# Altium schematic sheet ivt33_kuznecov_list2_9var.SchDoc
size 420 x 297 mm; SheetNumber: 2; SheetTotal: 2
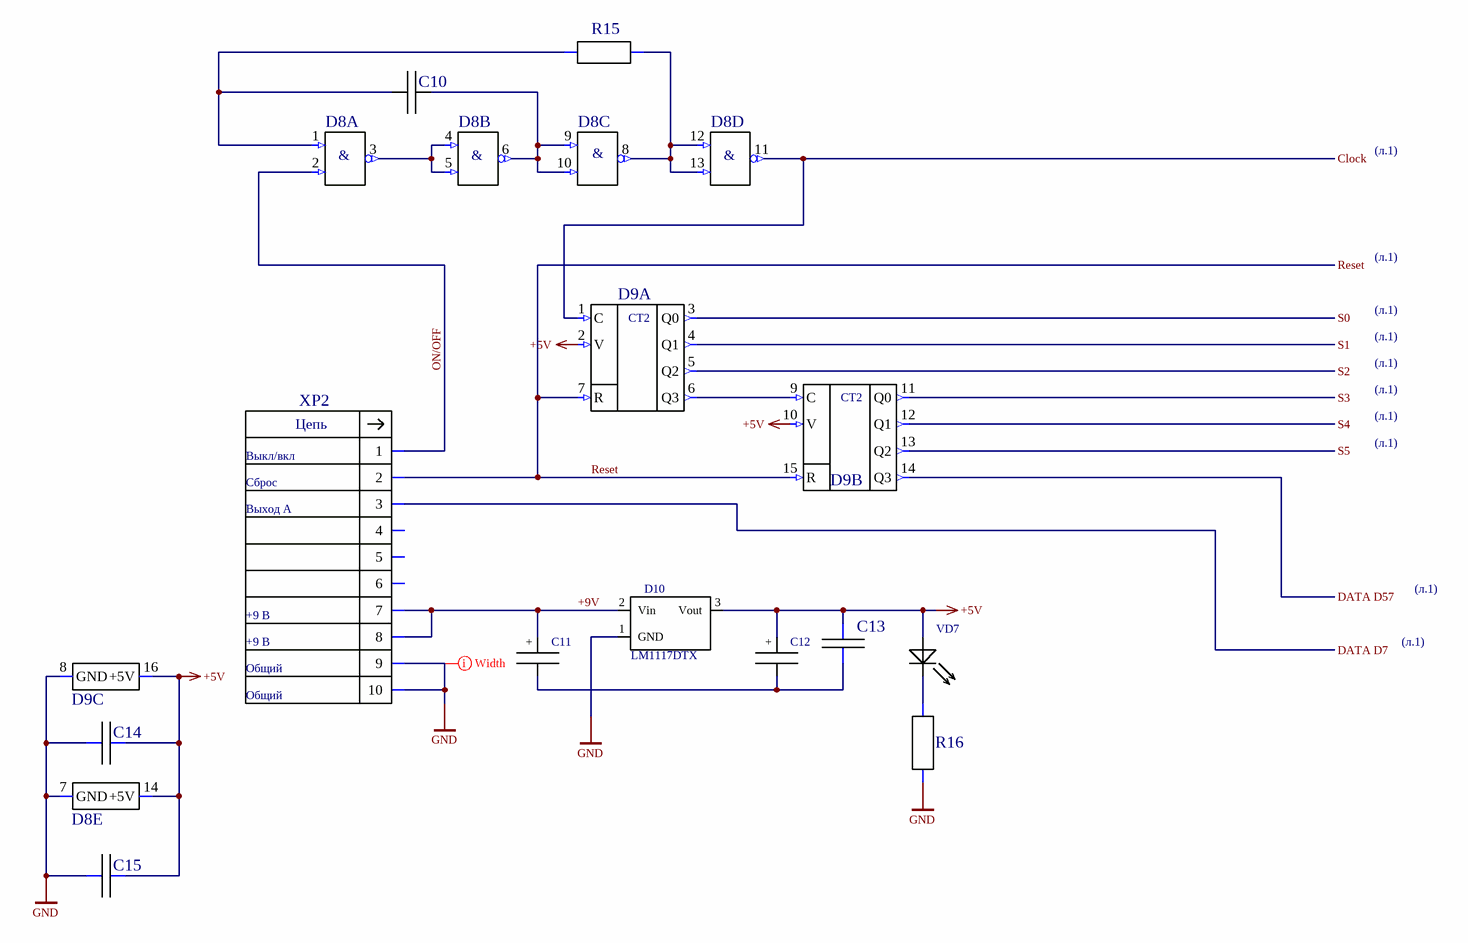
[diagram p0: ivt33_kuznecov_list2_9var.SchDoc]

## Parts
C10  1210  [K10-79_3.2_2.5(1210)]  (value not drawn)
C11  *  [CA010M0010REB-0405]  (value not drawn)
C12  *  [CA010M0010REB-0405]  (value not drawn)
C13  (no value)  [0805_N]
C14  (no value)  [0805_N]
C15  (no value)  [0805_N]
D8  74AC00SC  [SO14-N]  (value not drawn)  (parts A,B,C,D,E of 5)
D9  (no value)  [SOIC-16W-N]  (parts A,B,C of 3)
D10  LM1117DTX  [LM1117DTX-5.0/NOPB]
R15  0805  [RES_0805_2012_N]  (value not drawn)
R16  (no value)  [RES_0603_1608_N]
VD7  *  [LED_5mm]  (value not drawn)
XP2  TE_1-1634689-0  [BH-10R]  (value not drawn)

## Ports
Clock (out), DATA D7 (out), DATA D57 (out), Reset (out), S0 (out), S1 (out), S2 (out), S3 (out), S4 (out), S5 (out)

## Nets
+5V: C12.+ C13.2 C14.2 C15.2 D8.14(+5V) D9.2(V) D9.10(V) D9.16(+5V) D10.3(Vout) VD7.A
GND: C14.1 C15.1 D8.7(GND) D9.8(GND) D10.1(GND) R16.1 XP2.9 XP2.10
+9V: C11.+ D10.2(Vin) XP2.7 XP2.8
Clock: D8.11(Out) D9.1(C) ; port Clock
DATA D7: XP2.3 ; port DATA D7
DATA D57: D9.14(Q3) ; port DATA D57
ON/OFF: D8.2(In2) XP2.1
Reset: D9.7(R) D9.15(R) XP2.2 ; port Reset
S0: D9.3(Q0) ; port S0
S1: D9.4(Q1) ; port S1
S2: D9.5(Q2) ; port S2
S3: D9.11(Q0) ; port S3
S4: D9.12(Q1) ; port S4
S5: D9.13(Q2) ; port S5
NetC10_1: C10.1 D8.1(In1) R15.1
NetC10_2: C10.2 D8.6(Out) D8.9(In1) D8.10(In2)
NetC11_-: C11.- C12.- C13.1
NetD8_3: D8.3(Out) D8.4(In1) D8.5(In2)
NetD8_8: D8.8(Out) D8.12(In1) D8.13(In2) R15.2
NetD9_6: D9.6(Q3) D9.9(C)
NetR16_2: R16.2 VD7.C

Not connected (* = marked no-connect by the designer): XP2 4 5 6

## Layout directives
mark named Width: GND

## Notes on the sheet
- (л.1)
- Выкл/вкл
- Сброс
- Выход A
- +9 В
- Общий
- Подп. дата
- Инв. № дубл.
- Взам. инв. №
- Подп. и дата
- Инв. № подл.
- Изм.
- Лист
- № докум.
- Подп.
- Дата
- ALTIUM GOSTBOM2.0 KEV
- Файл:
- Копировал
- Формат А3
- (in symbol 74AC00SC, part A) &
- (in symbol 74AC00SC, part B) &
- (in symbol 74AC00SC, part C) &
- (in symbol 74AC00SC, part D) &
- (in symbol MC14520BDWG, part A) CT2
- (in symbol MC14520BDWG, part B) CT2
- (in symbol TE_1-1634689-0) Цепь

## Library data of the parts
C10 = К10-79_1210_Н30: Чип конденсатор 1210 Н30 ряд Е6; Manufacturer: ООО "Кулон"; Name: Конденсатор К10-79; Reliability: 0.000005; Permit MPSU: разрешен; LiveStatus: производится; Packing: катушка; LibraryEngeneer: Желобаев; Tolerance: ±20%; Datum: 19_12_2018; TU: АЖЯР.673511.004 ТУ; Type: K10-79; Hight: 1.75; BOM: Конденсатор К10-79-*-B-*±20%-Н30 АЖЯР.673511.004 ТУ; Version: 00; HelpURL: \\papa\Info\Altium_Library\Даташиты_и_ТУ\Конденсаторы_отечественные\К10-79_АЖЯР_673511_004ТУ.pdf; Weight: 0.2; Voltage: *; TKE: Н30; Size: 1210; Value: *; Value_KD: *
C11 C12 = CA010M0010REB-0405: Электролитический SND
C13-C15 = К10-79_0805_Н90: Чип конденсатор 0805 Н90 ряд Е6; Manufacturer: ООО "Кулон"; Name: К10-79; Tolerance: +80%-20%; TU: АЖЯР.673511.004 ТУ; Type: K10-79; BOM: К10-79-*-B-*+80%-20%-Н90 АЖЯР.673511.004 ТУ; Created_by: Желобаев; Name2: Конденсатор К10-79; Version: 0; Weight: 0.05; Voltage: *; TKE: Н90; Value: *; Value_KD: *; Case: 0805; Issue_date: 19_12_2018
D8 = 74AC00SC: 4 элемента 2И-НЕ TTL SOIC-14; Manufacturer: ON Semiconductor; BOM: 74AC00SC "ON Semiconductor"; Created_by: Желобаев; Power_Voltage: 4.5 - 5.5 V; Name2: Микросхема 74AC00SC; Issue_date: 10.04.2019; Case: SOIC-14; Version: 0; Name: 74AC00SC
D9 = MC14520BDWG: Два двоичных счетчика; Manufacturer: Motorola; Created_by: Желобаев; BOM: MC14520BDWG "Motorola"; Name2: Микросхема MC14520BDWG; Issue_date: 6.01.2019; Version: 0; Name: MC14520BDWG; Case: SOIC-16
D10 = LT1117
R15 = Р1-12-0,125-5%: Резистор от 0,75 Ом до 2 МОм; Manufacturer: ОАО "НПО "Эркон"; Tolerance: 5%; Created_by: Желобаев; TU: АЛЯР.434110.005 ТУ; Voltage: 150; TKR: M; BOM: Р1-12-0,125 * 5%-M-"A" АЛЯР.434110.005 ТУ; Name2: Резистор Р1-12-0,125; Issue_Date: 05_12_2018; Version: 00; Type: Р1-12-0,125±5%-М-"А"; Weight: 0,01; Size: 0805; Name: Р1-12-0,125; Value_KD: *; Case: 0805
R16 = Р1-12-0,1-5%: Резистор от 0,75 Ом до 10 МОм; Manufacturer: ОАО "НПО "Эркон"; Tolerance: 5%; TU: АЛЯР.434110.005 ТУ; Voltage: 50; TKR: M; BOM: Р1-12-0,1 * 5%-M-"A" АЛЯР.434110.005 ТУ; Created_by: Желобаев; Name2: Резистор Р1-12-0,1; Version: 00; Type: Р1-12-0,1±5%-М-"А"; Weight: 0,005; Size: 0603; Name: Р1-12-0,1; Value_KD: *; Issue_date: 10.04.2019; Case: 0603
VD7 = 521-9466: Светодиод,5мм,жёлтый; Manufacture: Dialight; BoM: 521-9466 "Dialight"; Name: 521-9466
XP2 = TE_1-1634689-0: Вилка типа BH-10R угловая правая двухрядная 2х5х2.54; Manufacturer: TE Connectivity; Created_by: Желобаев; BOM: TE_1-1634689-0 "TE Connectivity"; Name2: Вилка угловая TE_1-1634689-0; Name: TE_1-1634689-0; Issue_date: 13.05.2019; Version: 0; Case: BH-10R